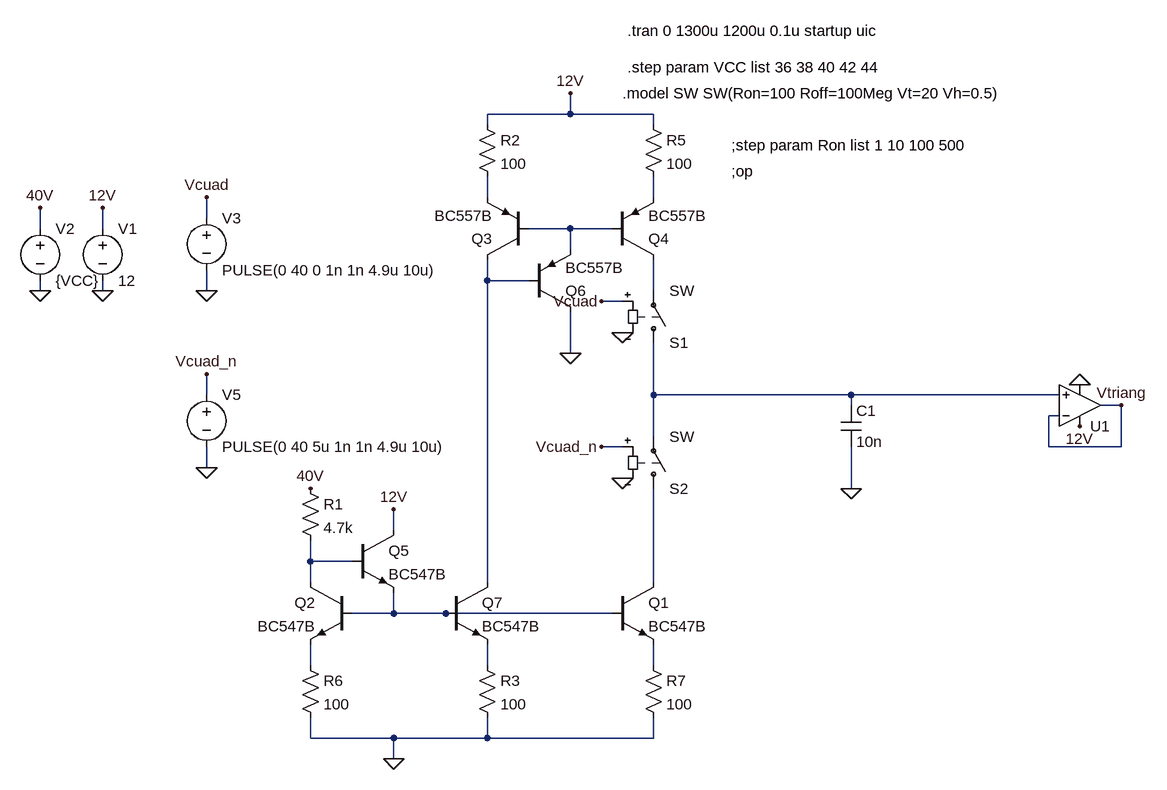
[diagram p0: schematic GenTriang_Amp_Adapt_a_VCC_frec_cte.asc]
GenTriang_Amp_Adapt_a_VCC_frec_cte.asc, the LTspice schematic file:
Version 4
SHEET 1 1400 804
WIRE 480 -208 480 -240
WIRE 480 -208 352 -208
WIRE 608 -208 480 -208
WIRE 352 -192 352 -208
WIRE 608 -192 608 -208
WIRE 352 -80 352 -112
WIRE 608 -80 608 -112
WIRE -80 -48 -80 -80
WIRE -336 -32 -336 -64
WIRE -240 -32 -240 -64
WIRE 480 -32 416 -32
WIRE 544 -32 480 -32
WIRE 480 0 480 -32
WIRE 352 48 352 16
WIRE 416 48 352 48
WIRE -336 64 -336 48
WIRE -240 64 -240 48
WIRE -80 64 -80 32
WIRE 608 64 608 16
WIRE 560 80 528 80
WIRE 480 160 480 96
WIRE -80 224 -80 192
WIRE 608 224 608 144
WIRE 912 224 608 224
WIRE 1232 224 912 224
WIRE 912 240 912 224
WIRE 1328 240 1296 240
WIRE 1232 256 1216 256
WIRE 608 288 608 224
WIRE 560 304 528 304
WIRE 1216 304 1216 256
WIRE 1328 304 1328 240
WIRE 1328 304 1216 304
WIRE -80 336 -80 304
WIRE 912 368 912 304
WIRE 208 432 208 400
WIRE 80 480 80 448
WIRE 144 480 80 480
WIRE 80 512 80 480
WIRE 352 512 352 48
WIRE 608 512 608 368
WIRE 208 560 208 528
WIRE 208 560 144 560
WIRE 288 560 208 560
WIRE 544 560 288 560
WIRE 80 640 80 608
WIRE 352 640 352 608
WIRE 608 640 608 608
WIRE 80 752 80 720
WIRE 208 752 80 752
WIRE 352 752 352 720
WIRE 352 752 208 752
WIRE 608 752 608 720
WIRE 608 752 352 752
WIRE 208 784 208 752
FLAG -336 64 0
FLAG -240 64 0
FLAG 912 368 0
FLAG -336 -64 40V
FLAG -240 -64 12V
FLAG 1328 240 Vtriang
FLAG 208 784 0
FLAG 480 -240 12V
FLAG 208 400 12V
FLAG 480 160 0
FLAG 528 80 Vcuad
FLAG 560 128 0
FLAG 80 368 40V
FLAG 528 304 Vcuad_n
FLAG 560 352 0
FLAG -80 64 0
FLAG -80 336 0
FLAG -80 -80 Vcuad
FLAG -80 192 Vcuad_n
FLAG 1264 272 12V
FLAG 1264 208 0
SYMBOL cap 896 240 R0
SYMATTR InstName C1
SYMATTR Value 10n
SYMBOL voltage -240 -48 R0
SYMATTR InstName V1
SYMATTR Value 12
SYMBOL voltage -336 -48 R0
WINDOW 123 0 0 Left 2
WINDOW 39 0 0 Left 2
SYMATTR InstName V2
SYMATTR Value {VCC}
SYMBOL npn 544 512 R0
SYMATTR InstName Q1
SYMATTR Value BC547B
SYMBOL npn 144 512 M0
SYMATTR InstName Q2
SYMATTR Value BC547B
SYMBOL pnp 416 16 R180
SYMATTR InstName Q3
SYMATTR Value BC557B
SYMBOL pnp 544 16 M180
SYMATTR InstName Q4
SYMATTR Value BC557B
SYMBOL res 336 -208 R0
SYMATTR InstName R2
SYMATTR Value 100
SYMBOL res 592 -208 R0
SYMATTR InstName R5
SYMATTR Value 100
SYMBOL res 64 624 R0
SYMATTR InstName R6
SYMATTR Value 100
SYMBOL res 592 624 R0
SYMATTR InstName R7
SYMATTR Value 100
SYMBOL npn 144 432 R0
SYMATTR InstName Q5
SYMATTR Value BC547B
SYMBOL pnp 416 96 M180
SYMATTR InstName Q6
SYMATTR Value BC557B
SYMBOL sw 608 160 M180
SYMATTR InstName S1
SYMBOL res 64 352 R0
SYMATTR InstName R1
SYMATTR Value 4.7k
SYMBOL sw 608 384 M180
SYMATTR InstName S2
SYMBOL npn 288 512 R0
SYMATTR InstName Q7
SYMATTR Value BC547B
SYMBOL res 336 624 R0
SYMATTR InstName R3
SYMATTR Value 100
SYMBOL voltage -80 -64 R0
WINDOW 123 0 0 Left 2
WINDOW 39 0 0 Left 2
SYMATTR InstName V3
SYMATTR Value PULSE(0 40 0 1n 1n 4.9u 10u)
SYMBOL voltage -80 208 R0
WINDOW 123 0 0 Left 2
WINDOW 39 0 0 Left 2
SYMATTR InstName V5
SYMATTR Value PULSE(0 40 5u 1n 1n 4.9u 10u)
SYMBOL Opamps\\UniversalOpamp2 1264 240 M180
SYMATTR InstName U1
TEXT 568 -336 Left 2 !.tran 0 1300u 1200u 0.1u startup uic
TEXT 568 -280 Left 2 !.step param VCC list 36 38 40 42 44
TEXT 560 -240 Left 2 !.model SW SW(Ron=100 Roff=100Meg Vt=20 Vh=0.5)
TEXT 728 -160 Left 2 !;step param Ron list 1 10 100 500
TEXT 728 -120 Left 2 !;op

The netlist it stands for:
* GenTriang_Amp_Adapt_a_VCC_frec_cte.asc
C1 N006 0 10n
V1 12V 0 12
V2 40V 0 {VCC}
Q1 N008 N009 N012 0 BC547B
Q2 N007 N009 N010 0 BC547B
Q3 N004 N003 N001 0 BC557B
Q4 N005 N003 N002 0 BC557B
R2 12V N001 100
R5 12V N002 100
R6 N010 0 100
R7 N012 0 100
Q5 12V N007 N009 0 BC547B
Q6 0 N004 N003 0 BC557B
S1 N006 N005 Vcuad 0 SW
R1 40V N007 4.7k
S2 N008 N006 Vcuad_n 0 SW
Q7 N004 N009 N011 0 BC547B
R3 N011 0 100
V3 Vcuad 0 PULSE(0 40 0 1n 1n 4.9u 10u)
V5 Vcuad_n 0 PULSE(0 40 5u 1n 1n 4.9u 10u)
XU1 N006 Vtriang 12V 0 Vtriang level.2 Avol=1Meg GBW=10Meg Slew=10Meg ilimit=25m rail=0 Vos=0 phimargin=45 en=0 enk=0 in=0 ink=0 Rin=500Meg  ; pins IN+ IN- V+ V- OUT
.model NPN NPN
.model PNP PNP
.lib standard.bjt
.tran 0 1300u 1200u 0.1u startup uic
.step param VCC list 36 38 40 42 44
.model SW SW(Ron=100 Roff=100Meg Vt=20 Vh=0.5)
;step param Ron list 1 10 100 500
;op
.lib UniversalOpamps2.sub
.backanno
.end